# Altium schematic sheet Input_Schematic.SchDoc
size A4
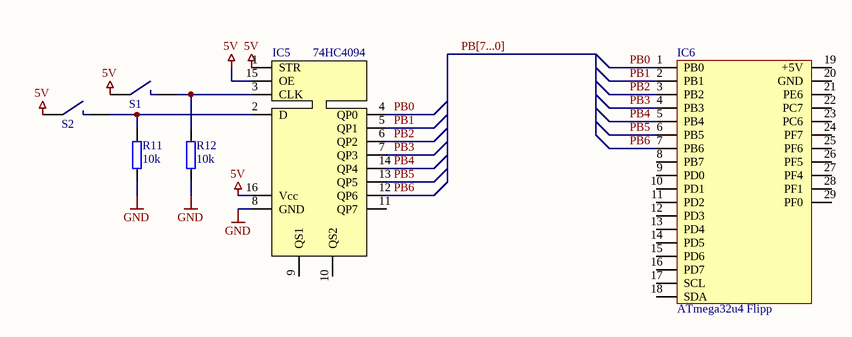
[diagram p0: Input_Schematic.SchDoc]

## Parts
IC5  74HC4094
IC6  ATmega32u4 Flipp
R11  10k  [Axial-04]
R12  10k  [Axial-04]
S1  Switch  (value not drawn)
S2  Switch  (value not drawn)

## Nets
5V: IC5.1(STR) IC5.15(OE) IC5.16(Vcc) S1.1 S2.1
GND: IC5.8(GND) R11.1 R12.1
PB0: IC5.4(QP0) IC6.1(PB0)
PB1: IC5.5(QP1) IC6.2(PB1)
PB2: IC5.6(QP2) IC6.3(PB2)
PB3: IC5.7(QP3) IC6.4(PB3)
PB4: IC5.14(QP4) IC6.5(PB4)
PB5: IC5.13(QP5) IC6.6(PB5)
PB6: IC5.12(QP6) IC6.7(PB6)
NetIC5_2: IC5.2(D) R11.2 S2.2
NetIC5_3: IC5.3(CLK) R12.2 S1.2

Not connected (* = marked no-connect by the designer): IC5 9(QS1) 10(QS2) 11(QP7); IC6 8(PB7) 9(PD0) 10(PD1) 11(PD2) 12(PD3) 13(PD4) 14(PD5) 15(PD6) 16(PD7) 17(SCL) 18(SDA) 19(+5V) 20(GND) 21(PE6) 22(PC7) 23(PC6) 24(PF7) 25(PF6) 26(PF5) 27(PF4) 28(PF1) 29(PF0)

## Buses and harness runs
bus PB[7...0]

## Library data of the parts
IC5 = 74HC4094: Serial Input, Serial and Parallel Output; 8 Bit
IC6 = Flipp
R11 R12 = Res: Value: 10k